# EAGLE design Backplane 2013 (EAGLE 5.06)
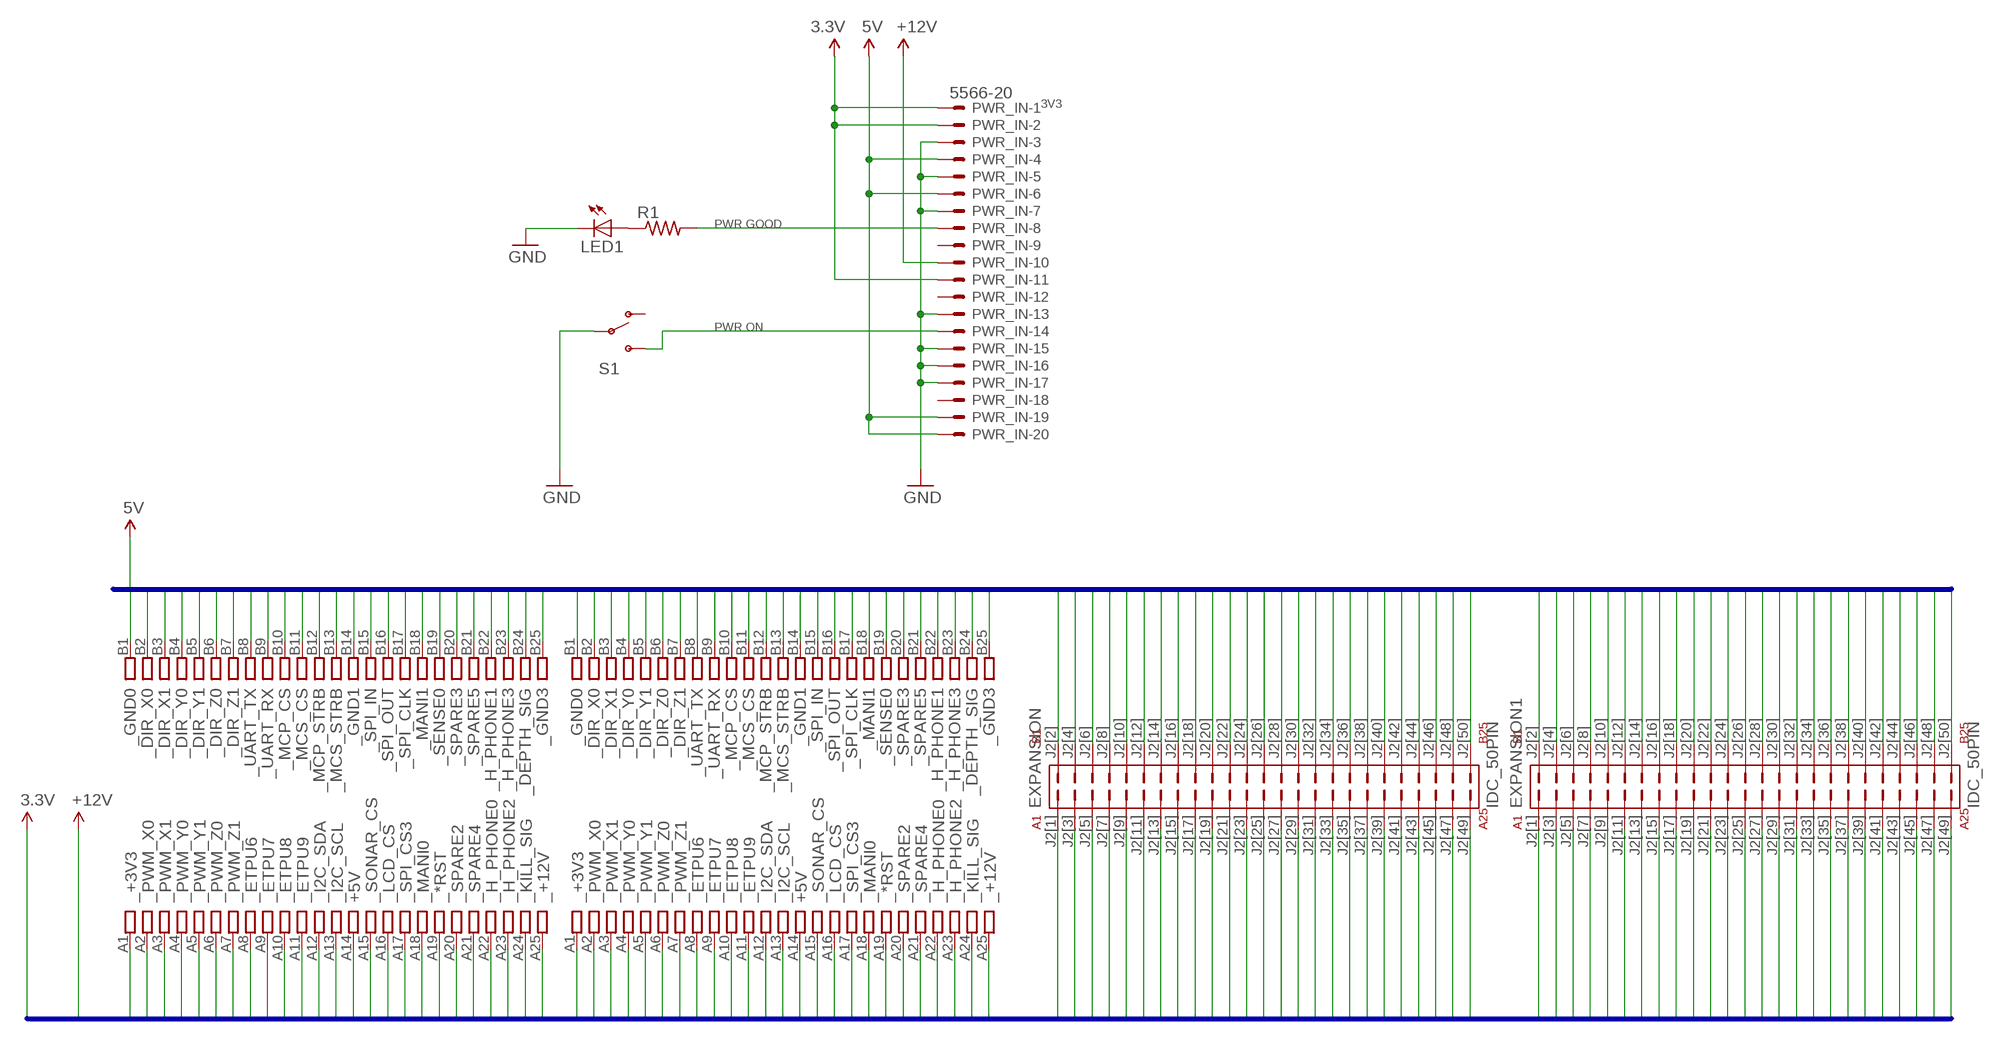
[diagram p0: schematic, sheet 1]

## Parts
EXPANSION  IDC_50PIN  [50PIN_BREAKOUT]
EXPANSION1  IDC_50PIN  [50PIN_BREAKOUT]
LED1  LED5MM  [LED5MM]
PWR_IN  5566-20  [5566-20]
R1  R-US_0204/7  [0204/7]
S1  SWITCH-SPST  [SWITCH-3PIN-5.47]
U$1  CONN_50PIN  [CONN_50PIN]
U$2  CONN_50PIN  [CONN_50PIN]

## Nets
3.3V: PWR_IN.1 PWR_IN.2 PWR_IN.11
3V3: EXPANSION1.J2[1](A1) EXPANSION.J2[1](A1) U$1.A1 U$2.A1 ; supply symbol labelled 3.3V
5V: EXPANSION1.J2[2](B1) EXPANSION.J2[2](B1) PWR_IN.4 PWR_IN.6 PWR_IN.19 PWR_IN.20 U$1.B1 U$2.B1
12V: EXPANSION1.J2[49](A25) EXPANSION.J2[49](A25) PWR_IN.10 U$1.A25 U$2.A25 ; supply symbol labelled +12V
DEPTH_SIG: EXPANSION1.J2[47](A24) EXPANSION.J2[47](A24) U$1.A24 U$2.A24
DIR_X0: EXPANSION1.J2[4](B2) EXPANSION.J2[4](B2) U$1.B2 U$2.B2
DIR_X1: EXPANSION1.J2[6](B3) EXPANSION.J2[6](B3) U$1.B3 U$2.B3
DIR_Y0: EXPANSION1.J2[8](B4) EXPANSION.J2[8](B4) U$1.B4 U$2.B4
DIR_Y1: EXPANSION1.J2[10](B5) EXPANSION.J2[10](B5) U$1.B5 U$2.B5
DIR_Z0: EXPANSION1.J2[12](B6) EXPANSION.J2[12](B6) U$1.B6 U$2.B6
DIR_Z1: EXPANSION1.J2[14](B7) EXPANSION.J2[14](B7) U$1.B7 U$2.B7
ETPU6: EXPANSION1.J2[15](A8) EXPANSION.J2[15](A8) U$1.A8 U$2.A8
ETPU7: EXPANSION1.J2[17](A9) EXPANSION.J2[17](A9) U$1.A9 U$2.A9
ETPU8: EXPANSION1.J2[19](A10) EXPANSION.J2[19](A10) U$1.A10 U$2.A10
ETPU9: EXPANSION1.J2[21](A11) EXPANSION.J2[21](A11) U$1.A11 U$2.A11
GND: EXPANSION1.J2[27](A14) EXPANSION1.J2[28](B14) EXPANSION1.J2[50](B25) EXPANSION.J2[27](A14) EXPANSION.J2[28](B14) EXPANSION.J2[50](B25) LED1.K(C) PWR_IN.3 PWR_IN.5 PWR_IN.7 PWR_IN.13 PWR_IN.15 PWR_IN.16 PWR_IN.17 S1.P$2(P) U$1.A14 U$1.B14 U$1.B25 U$2.A14 U$2.B14 U$2.B25
H_PHONE0: EXPANSION1.J2[43](A22) EXPANSION.J2[43](A22) U$1.A22 U$2.A22
H_PHONE1: EXPANSION1.J2[44](B22) EXPANSION.J2[44](B22) U$1.B22 U$2.B22
H_PHONE2: EXPANSION1.J2[45](A23) EXPANSION.J2[45](A23) U$1.A23 U$2.A23
H_PHONE3: EXPANSION1.J2[46](B23) EXPANSION.J2[46](B23) U$1.B23 U$2.B23
I2C_SCL: EXPANSION1.J2[25](A13) EXPANSION.J2[25](A13) U$1.A13 U$2.A13
I2C_SDA: EXPANSION1.J2[23](A12) EXPANSION.J2[23](A12) U$1.A12 U$2.A12
KILL_SIG: EXPANSION1.J2[48](B24) EXPANSION.J2[48](B24) U$1.B24 U$2.B24
MANI0: EXPANSION1.J2[35](A18) EXPANSION.J2[35](A18) U$1.A18 U$2.A18
MANI1: EXPANSION1.J2[36](B18) EXPANSION.J2[36](B18) U$1.B18 U$2.B18
MANI2: EXPANSION1.J2[37](A19) EXPANSION.J2[37](A19) U$1.A19 U$2.A19
MCP_CS: EXPANSION1.J2[20](B10) EXPANSION.J2[20](B10) U$1.B10 U$2.B10
MCP_STRB: EXPANSION1.J2[22](B11) EXPANSION.J2[22](B11) U$1.B11 U$2.B11
MCS_CS: EXPANSION1.J2[24](B12) EXPANSION.J2[24](B12) U$1.B12 U$2.B12
MCS_STRB: EXPANSION1.J2[26](B13) EXPANSION.J2[26](B13) U$1.B13 U$2.B13
N$1: LED1.A R1.1
N$10: PWR_IN.14 S1.P$3(S)
N$11: PWR_IN.8 R1.2
PWM_X0: EXPANSION1.J2[3](A2) EXPANSION.J2[3](A2) U$1.A2 U$2.A2
PWM_X1: EXPANSION1.J2[5](A3) EXPANSION.J2[5](A3) U$1.A3 U$2.A3
PWM_Y0: EXPANSION1.J2[7](A4) EXPANSION.J2[7](A4) U$1.A4 U$2.A4
PWM_Y1: EXPANSION1.J2[9](A5) EXPANSION.J2[9](A5) U$1.A5 U$2.A5
PWM_Z0: EXPANSION1.J2[11](A6) EXPANSION.J2[11](A6) U$1.A6 U$2.A6
PWM_Z1: EXPANSION1.J2[13](A7) EXPANSION.J2[13](A7) U$1.A7 U$2.A7
SENSE0: EXPANSION1.J2[38](B19) EXPANSION.J2[38](B19) U$1.B19 U$2.B19
SPARE0: EXPANSION1.J2[16](B8) EXPANSION.J2[16](B8) U$1.B8 U$2.B8
SPARE1: EXPANSION1.J2[18](B9) EXPANSION.J2[18](B9) U$1.B9 U$2.B9
SPARE2: EXPANSION1.J2[39](A20) EXPANSION.J2[39](A20) U$1.A20 U$2.A20
SPARE3: EXPANSION1.J2[40](B20) EXPANSION.J2[40](B20) U$1.B20 U$2.B20
SPARE4: EXPANSION1.J2[41](A21) EXPANSION.J2[41](A21) U$1.A21 U$2.A21
SPARE5: EXPANSION1.J2[42](B21) EXPANSION.J2[42](B21) U$1.B21 U$2.B21
SPI_CLK: EXPANSION1.J2[33](A17) EXPANSION.J2[33](A17) U$1.A17 U$2.A17
SPI_CS1: EXPANSION1.J2[30](B15) EXPANSION.J2[30](B15) U$1.B15 U$2.B15
SPI_CS2: EXPANSION1.J2[32](B16) EXPANSION.J2[32](B16) U$1.B16 U$2.B16
SPI_CS3: EXPANSION1.J2[34](B17) EXPANSION.J2[34](B17) U$1.B17 U$2.B17
SPI_IN: EXPANSION1.J2[29](A15) EXPANSION.J2[29](A15) U$1.A15 U$2.A15
SPI_OUT: EXPANSION1.J2[31](A16) EXPANSION.J2[31](A16) U$1.A16 U$2.A16
Unconnected: PWR_IN.9 PWR_IN.12 PWR_IN.18 S1.P$1(O)

## Buses
5V,DIR_X0,DIR_X1,DIR_Y0,DIR_Y1,DIR_Z0,DIR_Z1,MCP_CS,MCP_STRB,MCS_CS,MCS_STRB,GND,SPI_CS1,SPI_CS2,SPI_CS3,MANI1,SENSE0,H_PHONE1,H_PHONE3,KILL_SIG,SPARE0,SPARE1,SPARE3,SPARE5
3V3,PWM_X0,PWM_X1,PWM_Y0,PWM_Y1,PWM_Z0,PWM_Z1,ETPU6,ETPU7,ETPU8,ETPU9,I2C_SDA,I2C_SCL,GND,SPI_IN,SPI_OUT,SPI_CLK,MANI0,MANI2,SPARE2,SPARE4,H_PHONE0,H_PHONE2,DEPTH_SIG,12V

## Notes on the sheet
- 3V3
- PWR GOOD
- PWR ON

## Library data of the parts
EXPANSION EXPANSION1 = ARVP:IDC_50PIN
LED1 = led:LED: LED OSRAM: - CHIPLED LG R971, LG N971, LY N971, LG Q971, LY Q971, LO R971, LY R971 LH N974, LH R974 LS Q976, LO Q976, LY Q976 LO Q996 - Hyper CHIPLED LW Q18S LB Q993, LB Q99A, LB R99A - SideLED LS A670, LO A670, LY A670, LG A670, LP A670 LB A673, LV A673, LT A673, LW A673 LH A674 LY A675 LS A676, LA A676, LO A676, LY A676, LW A676 LS A679, LY A679, LG A679 - Hyper Micro SIDELED® LS Y876, LA Y876, LO Y876, LY Y876 LT Y87S - SmartLED LW L88C, LW L88S LB L89C, LB L89S, LG L890 LS L89K, LO L89K, LY L89K LS L896, LA L896, LO L896, LY L896 - TOPLED LS T670, LO T670, LY T670, LG T670, LP T670 LSG T670, LSP T670, LSY T670, LOP T670, LYG T670 LG T671, LOG T671, LSG T671 LB T673, LV T673, LT T673, LW T673 LH T674 LS T676, LA T676, LO T676, LY T676, LB T676, LH T676, LSB T676, LW T676 LB T67C, LV T67C, LT T67C, LS T67K, LO T67K, LY T67K, LW E67C LS E67B, LA E67B, LO E67B, LY E67B, LB E67C, LV E67C, LT E67C LW T67C LS T679, LY T679, LG T679 LS T770, LO T770, LY T770, LG T770, LP T770 LB T773, LV T773, LT T773, LW T773 LH T774 LS E675, LA E675, LY E675, LS T675 LS T776, LA T776, LO T776, LY T776, LB T776 LHGB T686 LT T68C, LB T68C - Hyper Mini TOPLED® LB M676 - Mini TOPLED Santana® LG M470 LS M47K, LO M47K, LY M47K Source: http://www.osram.convergy.de LUXEON: - LUMILED® LXK2-PW12-R00, LXK2-PW12-S00, LXK2-PW14-U00, LXK2-PW14-V00 LXK2-PM12-R00, LXK2-PM12-S00, LXK2-PM14-U00 LXK2-PE12-Q00, LXK2-PE12-R00, LXK2-PE12-S00, LXK2-PE14-T00, LXK2-PE14-U00 LXK2-PB12-K00, LXK2-PB12-L00, LXK2-PB12-M00, LXK2-PB14-N00, LXK2-PB14-P00, LXK2-PB14-Q00 LXK2-PR12-L00, LXK2-PR12-M00, LXK2-PR14-Q00, LXK2-PR14-R00 LXK2-PD12-Q00, LXK2-PD12-R00, LXK2-PD12-S00 LXK2-PH12-R00, LXK2-PH12-S00 LXK2-PL12-P00, LXK2-PL12-Q00, LXK2-PL12-R00 Source: www.luxeon.com KINGBRIGHT: KA-3528ASYC Source: www.kingbright.com
PWR_IN = con-molex:5566-20: Mini FIT connector 20 pol ATX PC-Motherboard Power connector Source: http://www.molex.com; OC_FARNELL: unknown; OC_NEWARK: unknown
R1 = resistor:R-US_: RESISTOR, American symbol
S1 = ARVP:SWITCH-SPST: SPST Switch Simple slide switch. Spark Fun Electronics SKU : COM-00102
U$1 U$2 = ARVP:CONN_50PIN

## Board
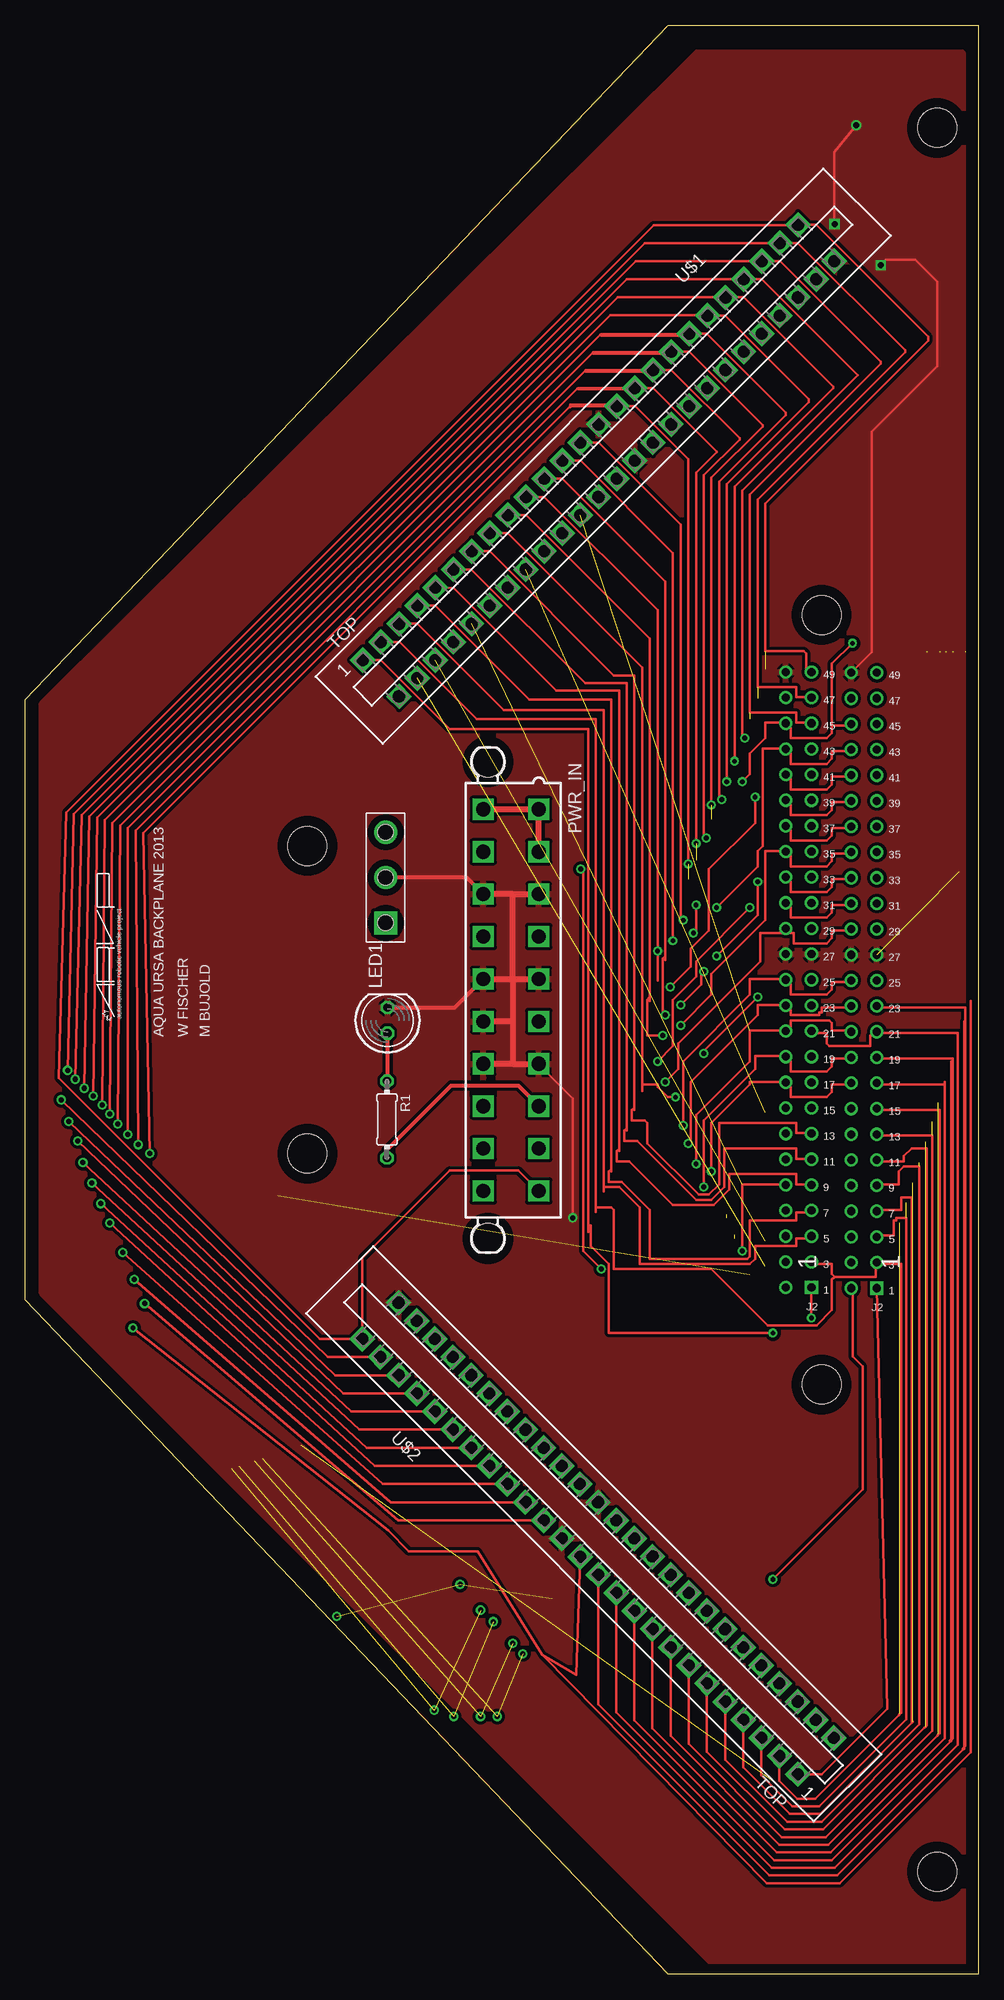
[diagram p1: board, top side]
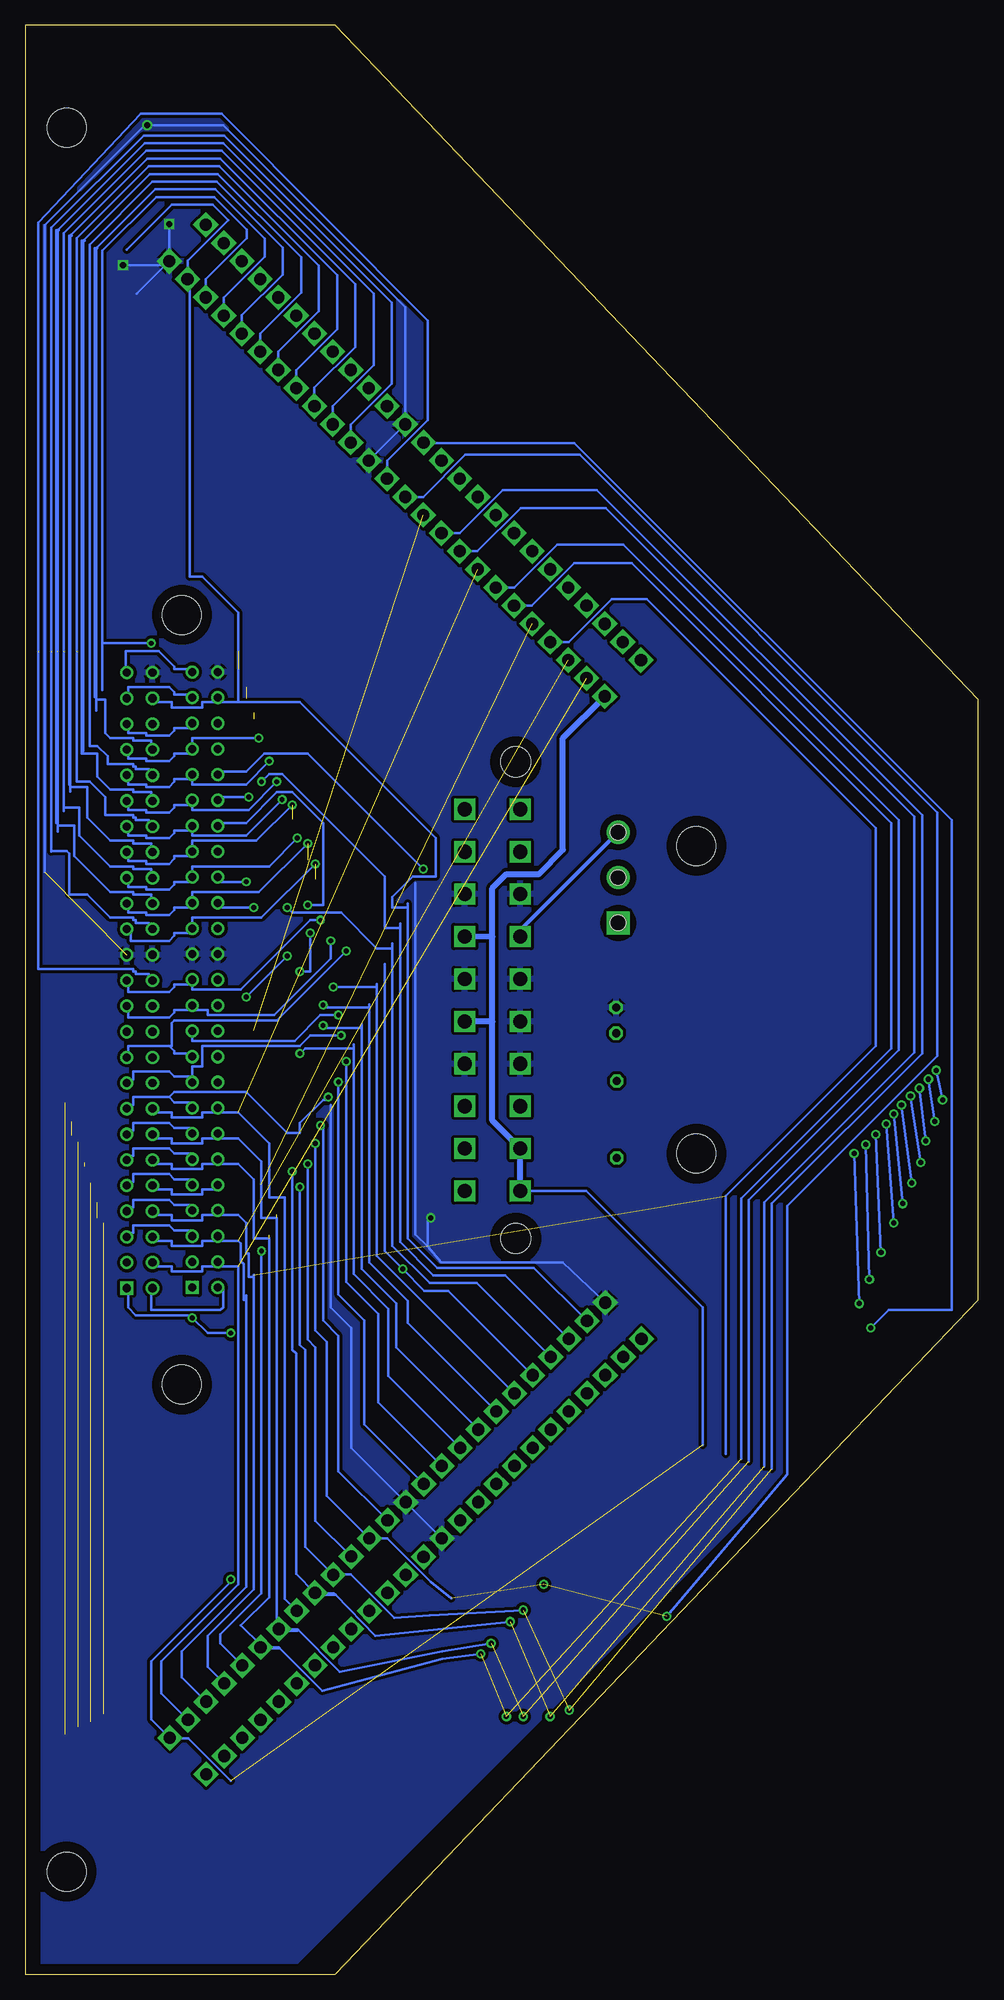
[diagram p2: board, bottom side, seen from below]

Size 94.39 x 193.04 mm. Coordinates in mm from the lower left corner, seen from the top.
Outline: 0,126.24 63.68,193.04 94.39,193.04 94.39,0 63.68,0 0,66.8 0,126.24
Copper layers (1*16): Top 0.035mm / dielectric 1.5mm / Bottom 0.035mm
Design rules "default *": minimum track width 10mil, minimum drill 19mil, track to track 7mil, track to pad 7mil, pad to pad 7mil, via to via 7mil, smd to smd 7mil, copper to edge 40mil, drill to drill 8mil, minimum pad ring 10mil, minimum via ring 8mil, stop-mask expansion 4mil, vias tented up to drill 0mil, thermal gap 10mil
Holes 3.86 mm at 27.94,111.76 90.3,182.88 90.3,10.16 27.94,81.28 78.87,134.62 78.87,58.42

### Footprints (pad centres in the part's own frame; a part is rotated, then mirrored left to right if it is on the bottom)
50PIN_BREAKOUT = drill 0.8 square: J2[1] -0.508,24.892 | drill 0.8 round: J2[2] 2.032,24.892; J2[3] -0.508,22.352; J2[4] 2.032,22.352; J2[5] -0.508,19.812; J2[6] 2.032,19.812; J2[7] -0.508,17.272; J2[8] 2.032,17.272; J2[9] -0.508,14.732; J2[10] 2.032,14.732; J2[11] -0.508,12.192; J2[12] 2.032,12.192; J2[13] -0.508,9.652; J2[14] 2.032,9.652; J2[15] -0.508,7.112; J2[16] 2.032,7.112; J2[17] -0.508,4.572; J2[18] 2.032,4.572; J2[19] -0.508,2.032; J2[20] 2.032,2.032; J2[21] -0.508,-0.508; J2[22] 2.032,-0.508; J2[23] -0.508,-3.048; J2[24] 2.032,-3.048; J2[25] -0.508,-5.588; J2[26] 2.032,-5.588; J2[27] -0.508,-8.128; J2[28] 2.032,-8.128; J2[29] -0.508,-10.668; J2[30] 2.032,-10.668; J2[31] -0.508,-13.208; J2[32] 2.032,-13.208; J2[33] -0.508,-15.748; J2[34] 2.032,-15.748; J2[35] -0.508,-18.288; J2[36] 2.032,-18.288; J2[37] -0.508,-20.828; J2[38] 2.032,-20.828; J2[39] -0.508,-23.368; J2[40] 2.032,-23.368; J2[41] -0.508,-25.908; J2[42] 2.032,-25.908; J2[43] -0.508,-28.448; J2[44] 2.032,-28.448; J2[45] -0.508,-30.988; J2[46] 2.032,-30.988; J2[47] -0.508,-33.528; J2[48] 2.032,-33.528; J2[49] -0.508,-36.068; J2[50] 2.032,-36.068
LED5MM = drill 0.813 octagon: A -1.27,0; K 1.27,0
5566-20 = drill 1.4 square: 1 18.9,-2.75; 2 14.7,-2.75; 3 10.5,-2.75; 4 6.3,-2.75; 5 2.1,-2.75; 6 -2.1,-2.75; 7 -6.3,-2.75; 8 -10.5,-2.75; 9 -14.7,-2.75; 10 -18.9,-2.75; 11 18.9,2.75; 12 14.7,2.75; 13 10.5,2.75; 14 6.3,2.75; 15 2.1,2.75; 16 -2.1,2.75; 17 -6.3,2.75; 18 -10.5,2.75; 19 -14.7,2.75; 20 -18.9,2.75 | hole 3: 23.6,2.29; -23.6,2.29
0204/7 = drill 0.813 octagon: 1 -3.81,0; 2 3.81,0
SWITCH-3PIN-5.47 = drill 1.524 square: P$1 0,0 | drill 1.524 round: P$2 0,-4.483; P$3 0,-8.966 | hole 1.524: 0,0; 0,-4.483; 0,-8.966
CONN_50PIN = drill 1.2 pad 1.778 square: A1 -30.446,-2.446; A2 -27.906,-2.446; A3 -25.366,-2.446; A4 -22.826,-2.446; A5 -20.286,-2.446; A6 -17.746,-2.446; A7 -15.206,-2.446; A8 -12.666,-2.446; A9 -10.126,-2.446; A10 -7.586,-2.446; A11 -5.046,-2.446; A12 -2.506,-2.446; A13 0,-2.446; A14 2.574,-2.446; A15 5.114,-2.446; A16 7.654,-2.446; A17 10.194,-2.446; A18 12.734,-2.446; A19 15.274,-2.446; A20 17.814,-2.446; A21 20.354,-2.446; A22 22.894,-2.446; A23 25.434,-2.446; A24 27.974,-2.446; A25 30.514,-2.446; B1 -30.446,-7.526; B2 -27.906,-7.526; B3 -25.366,-7.526; B4 -22.826,-7.526; B5 -20.286,-7.526; B6 -17.746,-7.526; B7 -15.206,-7.526; B8 -12.666,-7.526; B9 -10.126,-7.526; B10 -7.586,-7.526; B11 -5.046,-7.526; B12 -2.506,-7.526; B13 0.034,-7.526; B14 2.574,-7.526; B15 5.114,-7.526; B16 7.654,-7.526; B17 10.194,-7.526; B18 12.734,-7.526; B19 15.274,-7.526; B20 17.814,-7.526; B21 20.354,-7.526; B22 22.894,-7.526; B23 25.434,-7.526; B24 27.974,-7.526; B25 30.514,-7.526

### Placement (x,y rotation side)
EXPANSION  83.82,92.85 180 top
EXPANSION1  77.34,92.91 180 top
LED1  35.87,94.48 90 top
PWR_IN  48.11,96.48 90 top
R1  35.82,84.66 270 top
S1  35.69,104.14 180 top
U$1  53.22,153.42 45 top
U$2  53.22,39.62 135 top
U$3  [ARVP]  9.53,94.61 90 top

### Tracks (layer width: path | path; a pad name or v marks a point on that pad's centre or on a via)
3.3V
  Top 0.61: PWR_IN.11 PWR_IN.1 PWR_IN.2
3V3  (via drill 0.48)
  Top 0.254: U$1.A1 35.19,130.16 42.04,123.32 55.75,123.32 55.75,74.17 | 55.75,74.17 55.75,73.53 | U$2.A1 78.88,19.82 85.34,26.28 EXPANSION.J2[1] | v77.85,65.02 EXPANSION1.J2[1] | v74.04,63.5 57.79,63.5 57.79,70.36 56.01,72.14 56.01,74.17 55.75,74.17
  Bottom 0.254: EXPANSION.J2[1] 84.2,67.82 84.2,66.04 83.44,65.28 78.1,65.28 v77.85,65.02 76.33,63.5 v74.04,63.5
5V  (via drill 0.48)  (1 unrouted)
  Top 0.254: v74.04,39.12 82.93,48.01 82.93,60.2 81.91,61.21 81.91,67.82 EXPANSION.J2[2]
  Bottom 0.254: 79.88,23.37 78.23,23.37 74.04,19.18 | 79.88,23.37 80.01,23.37 | PWR_IN.20 38.84,77.58 27.3,66.04 27.3,52.45 | EXPANSION.J2[2] 81.91,67.82 81.91,65.79 75.06,65.79 74.8,66.04 74.8,67.82 75.31,67.82 EXPANSION1.J2[2] | v74.04,39.12 74.04,38.86 81.91,30.99 81.91,25.26 U$2.B1 79.88,23.37
  Bottom 0.61: PWR_IN.20 PWR_IN.19 48.13,84.56 48.13,94.36 | U$1.B1 41.15,122.43 41.15,111.38 43.56,108.97 46.74,108.97 48.13,107.57 48.13,102.74 | 48.13,94.36 48.13,102.74 | 48.13,94.36 PWR_IN.6 | 48.13,102.74 PWR_IN.4
12V  (1 unrouted)
  Top 0.254: 76.33,173.23 62.23,173.23 4.06,115.06 3.3,88.77 29.15,62.93 U$2.A25 33.37,70.96 42.04,79.63 48.81,79.63 PWR_IN.10 | 76.33,173.23 76.45,173.23 | EXPANSION1.J2[49] 77.85,129.03 77.34,129.03 77.34,130.81 77.09,131.06 73.28,131.06 73.28,145.67 89.41,161.8 89.41,162.18 78.32,173.27 U$1.A25 76.33,173.23
  Bottom 0.254: EXPANSION.J2[49] 84.46,129.03 84.46,131.06 81.15,131.06 79.63,129.54 79.63,129.29 78.1,129.29 77.85,129.03 EXPANSION1.J2[49]
DEPTH_SIG  (via drill 0.5)  (1 unrouted)
  Top 0.254: 74.55,171.45 61.34,171.45 4.83,114.94 v4.19,89.53 | 74.55,171.45 74.68,171.45 | v3.56,86.61 29.93,61.13 U$2.A24 | EXPANSION1.J2[47] 77.85,126.49 76.33,126.49 76.33,127.51 72.52,127.51 72.52,146.05 87.12,160.66 87.12,160.85 76.5,171.47 U$1.A24 74.55,171.45
  Bottom 0.254: v3.56,86.61 v4.19,89.53 | EXPANSION.J2[47] 84.2,126.49 84.2,127.51 80.14,127.51 79.63,127 79.63,126.75 78.1,126.75 77.85,126.49 EXPANSION1.J2[47]
DIR_X0  (1 unrouted)
  Bottom 0.254: U$2.B2 80.9,27.84 80.9,30.99 73.28,38.61 73.28,70.1 75.06,70.1 75.31,70.36 | 75.31,70.36 75.56,70.1 76.84,70.1 76.84,69.6 79.88,69.6 79.88,70.1 81.41,70.1 81.66,70.36 EXPANSION.J2[4] | 75.31,70.36 EXPANSION1.J2[4]
DIR_X1  (1 unrouted)
  Bottom 0.254: 72.52,66.8 72.52,38.35 78.87,32 78.87,29.4 U$2.B3 | 72.52,66.8 72.52,67.25 | 75.31,72.9 75.56,72.64 76.84,72.64 76.84,72.14 79.88,72.14 79.88,72.64 81.41,72.64 81.66,72.9 EXPANSION.J2[6] | 75.31,72.9 75.06,72.64 73.28,72.64 73.03,72.39 73.03,70.61 72.77,70.36 72.77,66.8 72.52,66.8 | 75.31,72.9 EXPANSION1.J2[6]
DIR_Y0  (1 unrouted)
  Bottom 0.254: 71.75,69.09 71.75,38.1 76.33,33.53 76.33,30.45 U$2.B4 | 71.75,69.09 71.75,69.25 | U$1.B4 40.57,131.96 36.32,136.21 32.83,136.21 10.16,113.54 10.16,91.95 25.02,77.09 25.02,51.56 | 75.31,75.44 75.56,75.18 76.84,75.18 76.84,74.68 79.88,74.68 79.88,75.18 81.41,75.18 81.66,75.44 EXPANSION.J2[8] | 75.31,75.44 75.06,75.18 73.28,75.18 72.52,74.42 72.52,71.37 72.26,71.37 72.26,69.09 71.75,69.09 | 75.31,75.44 EXPANSION1.J2[8]
DIR_Y1  (via drill 0.48)  (1 unrouted)
  Top 0.254: v70.99,71.63 70.99,78.23 75.31,78.23 EXPANSION1.J2[10]
  Bottom 0.254: U$2.B5 75.06,32.77 75.06,33.65 70.99,37.72 v70.99,71.63 | EXPANSION.J2[10] 81.66,77.98 81.41,77.72 79.88,77.72 79.88,77.22 76.84,77.22 76.84,77.72 75.56,77.72 75.31,77.98 EXPANSION1.J2[10]
DIR_Z0  (via drill 0.5)  (3 unrouted)
  Bottom 0.254: 71.12,32.38 69.28,32.38 69.18,32.29 | 69.18,32.29 64.96,28.07 53.09,31.24 v49.28,31.75 | U$1.B6 44.22,135.55 40.01,139.76 34.35,139.76 8.64,114.05 8.64,91.69 23.5,76.83 23.5,51.05 | 75.31,80.52 75.56,80.26 76.84,80.26 76.84,79.76 79.88,79.76 79.88,80.26 81.41,80.26 81.66,80.52 EXPANSION.J2[12] | 75.31,80.52 75.06,80.26 73.28,80.26 71.75,78.74 71.75,72.9 70.23,72.9 70.23,37.34 73.03,34.54 71.09,32.61 U$2.B6 70.99,32.26 69.22,32.26 69.18,32.29 | 75.31,80.52 EXPANSION1.J2[12]
  other vias: 46.74,25.53
DIR_Z1  (via drill 0.5)  (3 unrouted)
  Bottom 0.254: 69.22,34.16 67.44,34.16 67.37,34.1 | 67.37,34.1 63.25,29.97 53.09,32 v48.26,32.77 | U$1.B7 45.98,137.35 41.72,141.6 35.18,141.6 7.87,114.3 7.87,91.57 22.73,76.71 22.73,50.8 | 75.31,83.06 75.56,82.8 76.84,82.8 76.84,82.3 79.88,82.3 79.88,82.8 81.41,82.8 81.66,83.06 EXPANSION.J2[14] | 75.31,83.06 75.06,82.8 73.28,82.8 70.99,80.52 70.99,74.93 69.47,74.93 69.47,34.37 U$2.B7 69.22,34.04 67.44,34.04 67.37,34.1 | 75.31,83.06 EXPANSION1.J2[14]
  other vias: 45.09,25.53
ETPU6  (via drill 0.48)  (1 unrouted)
  Top 0.254: U$1.A8 47.77,142.73 61.09,129.41 61.09,88.14 | 61.09,88.14 61.09,87.5 | U$2.A8 63.9,23.6 74.68,12.83 79.5,12.83 90.3,23.62 | 90.3,23.62 90.42,23.75 | 90.3,23.62 90.55,23.88 90.55,85.6 84.46,85.6 EXPANSION.J2[15] | 61.09,88.14 62.61,88.14 62.61,87.88 63.63,86.87 v64.39,86.87
  Bottom 0.254: 80.14,86.87 79.63,86.36 77.85,86.36 EXPANSION1.J2[15] | 80.14,86.87 83.69,86.87 83.69,86.11 84.2,86.11 84.46,85.85 EXPANSION.J2[15] | v64.39,86.87 64.39,86.61 64.9,86.61 67.18,84.33 67.18,83.31 68.45,83.31 72.52,87.38 79.63,87.38 80.14,86.87
ETPU7  (via drill 0.48)
  Top 0.254: U$1.A9 49.59,144.53 61.85,132.27 61.85,96.77 | 61.85,96.77 61.85,96.39 | U$2.A9 62.11,24.38 74.42,12.06 79.76,12.06 91.06,23.37 91.06,88.14 | 91.06,88.14 91.06,88.39 | 91.06,88.14 84.46,88.14 EXPANSION.J2[17] | v63.12,92.96 61.6,92.96 61.6,96.52 61.85,96.77
  Bottom 0.254: 77.85,88.9 79.63,88.9 80.14,89.41 83.69,89.41 83.69,88.65 84.2,88.65 84.46,88.39 EXPANSION.J2[17] | 77.85,88.9 EXPANSION1.J2[17] 77.85,88.9 | 77.85,88.9 77.85,89.92 76.84,89.92 76.84,91.95 67.18,91.95 66.17,92.96 v63.12,92.96
ETPU8  (via drill 0.48)
  Top 0.254: U$1.A10 51.41,146.33 62.61,135.13 v62.61,101.35 62.61,98.42 | U$2.A10 60.31,25.16 74.17,11.3 79.88,11.3 91.63,23.05 | 91.63,23.05 91.69,23.11 91.69,90.42 | EXPANSION.J2[19] 84.46,90.68 91.82,90.68 91.82,23.37 91.57,23.11 91.63,23.05
  Bottom 0.254: 80.14,91.95 84.2,91.95 84.2,90.93 EXPANSION.J2[19] | 80.14,91.95 79.63,91.44 79.63,91.19 78.1,91.19 77.85,90.93 EXPANSION1.J2[19] | v62.61,101.35 69.47,94.49 79.63,94.49 79.88,94.23 79.88,91.95 80.14,91.95
ETPU9  (via drill 0.48)
  Top 0.254: U$1.A11 53.17,148.12 63.37,137.92 63.37,100.84 | 63.37,100.84 63.37,100.46 | U$2.A11 58.51,25.94 73.91,10.54 80.14,10.54 92.33,22.73 92.33,93.22 84.46,93.22 EXPANSION.J2[21] 84.2,93.22 84.2,92.96 83.69,92.96 83.69,91.95 79.63,91.95 79.38,92.2 79.38,93.22 77.85,93.22 EXPANSION1.J2[21] | v63.37,95 63.12,95.25 63.12,100.58 63.37,100.84
  Bottom 0.254: v63.37,95 65.15,95 67.69,92.46 77.85,92.46 EXPANSION1.J2[21]
GND  (via drill 0.5, 0.6)  (1 unrouted)
  Top 0.254: 50.8,90.17 54.23,86.74 v54.23,74.93 | v82.3,183.13 80.12,180.44 80.12,172.87 v80.14,173.35 | EXPANSION.J2[50] 83.81,130.94 83.81,152.77 90.3,159.26 90.3,167.64 88.14,169.8 85.22,169.8 v84.71,169.29
  Top 0.406: LED1.K 42.53,95.75 PWR_IN.15 | S1.P$2 43.71,108.62 PWR_IN.13
  Top 0.61: 48.26,106.98 PWR_IN.13 | 48.26,106.98 PWR_IN.3 | 48.26,98.58 PWR_IN.5 | 48.26,98.58 48.26,106.98 | 48.26,94.38 PWR_IN.16 | 48.26,98.58 48.26,94.38 | PWR_IN.15 48.26,98.58 | 48.26,94.38 48.26,90.18 | 48.26,90.18 PWR_IN.7 | 48.26,90.18 PWR_IN.17
  Bottom 0.254: U$2.B25 41.18,70.48 53.21,70.48 54.55,72.07 | 54.55,72.07 55.75,73.28 55.75,108.07 | U$2.A14 U$2.B14 62.1,52.15 62.1,64.01 64.13,66.04 64.13,86.07 | U$1.B25 83.34,166.45 | U$1.B14 U$1.A14 56.77,165.1 74.8,183.13 v82.3,183.13 82.55,183.13 92.46,173.23 92.46,130.94 | 92.46,109.16 92.46,130.94 | 92.46,130.94 92.46,131.06 | v54.23,74.93 54.55,74.61 54.55,72.07 | v80.14,173.35 80.14,169.7 U$1.B25 | v84.71,169.29 80.5,169.29 U$1.B25
  pour Top (isolate 0.305): 66.55,190.37 92.71,190.37 92.84,190.25 92.84,0.76 68.33,0.76 1.65,67.44 1.65,125.6 1.65,125.86
  pour Bottom (isolate 0.305): 66.29,190.37 92.46,190.37 92.58,190.25 92.58,0.76 68.07,0.76 1.4,67.44 1.4,125.86
H_PHONE0  (via drill 0.48, 0.5)
  Top 0.254: 70.99,122.43 70.99,122.3 | 70.99,122.43 70.99,146.94 82.42,158.37 72.91,167.88 U$1.A22 70.99,167.89 | 70.99,167.89 59.56,167.89 6.35,114.68 v5.84,87.76 | 70.99,167.89 71.12,167.89 | v5.21,82.55 31.49,57.54 U$2.A22 | 70.99,122.43 v71.25,122.43
  Bottom 0.254: v5.84,87.76 v5.21,82.55 | EXPANSION.J2[43] 84.2,121.16 84.2,120.4 82.42,120.4 82.42,120.14 80.14,120.14 79.63,120.65 79.63,120.9 78.1,120.9 77.85,121.16 EXPANSION1.J2[43] 77.85,122.43 v71.25,122.43
H_PHONE1  (via drill 0.48)
  Top 0.254: 75.31,121.41 75.82,120.9 75.82,119.89 79.38,119.89 79.88,120.4 79.88,121.16 81.66,121.16 EXPANSION.J2[44] | 75.31,121.41 73.03,121.41 73.03,111.76 72.52,111.25 72.52,109.73 v68.45,105.66 | 75.31,121.41 EXPANSION1.J2[44]
  Bottom 0.254: U$2.B22 49.67,68.45 54.36,68.45 58.04,72.14 58.04,101.6 | 58.04,101.6 58.04,102.07 | U$1.B22 74.73,166.06 70.68,170.12 70.68,171.89 75.56,176.78 81.53,176.78 87.31,171.01 | 87.31,171.01 87.38,170.94 87.38,125.16 | v68.45,105.66 67.94,105.16 63.12,105.16 59.56,101.6 58.04,101.6 | EXPANSION.J2[44] 81.91,121.41 81.91,122.17 83.69,122.17 83.69,122.43 85.98,122.43 86.49,122.94 86.49,126.24 87.25,126.24 87.5,126.49 87.5,170.94 87.25,170.94 87.31,171.01
H_PHONE2  (via drill 0.5)  (1 unrouted)
  Top 0.254: 72.77,169.67 60.45,169.67 5.59,114.81 v4.95,88.65 | 72.77,169.67 72.9,169.67 | v4.32,84.45 30.71,59.33 U$2.A23 | EXPANSION1.J2[45] 77.85,123.95 76.33,123.95 76.33,124.97 71.75,124.97 71.75,146.56 84.71,159.51 84.71,159.7 74.74,169.68 U$1.A23 72.77,169.67
  Bottom 0.254: v4.95,88.65 v4.32,84.45 | EXPANSION.J2[45] 84.2,123.7 84.2,122.94 82.42,122.94 82.42,122.68 80.14,122.68 79.63,123.19 79.63,123.44 78.1,123.44 77.85,123.7 EXPANSION1.J2[45]
H_PHONE3  (via drill 0.48)
  Top 0.254: 79.88,123.7 81.66,123.7 EXPANSION.J2[46] | 79.88,123.7 79.88,122.94 79.38,122.43 75.82,122.43 75.82,123.44 75.31,123.95 | 79.88,123.7 79.88,129.79 v81.91,131.83 | 75.31,123.95 73.28,123.95 73.28,122.43 71.75,120.9 71.75,118.87 v70.99,118.11 | 75.31,123.95 EXPANSION1.J2[46]
  Bottom 0.254: U$2.B23 46.84,69.22 53.98,69.22 57.28,72.52 57.28,103.63 | 57.28,103.63 57.28,104.07 | U$1.B23 76.52,167.89 72.45,171.96 72.45,172.78 75.69,176.02 81.41,176.02 86.74,170.69 86.74,131.83 | 86.74,131.83 86.74,127.19 | v81.91,131.83 86.74,131.83 | v70.99,118.11 70.23,118.87 68.96,118.87 58.8,108.71 58.8,103.63 57.28,103.63
I2C_SCL  (via drill 0.48)
  Top 0.254: U$1.A13 56.78,151.69 64.9,143.57 64.9,104.39 v65.15,104.39 | U$2.A13 54.56,29.64 51.18,31.62 | 51.18,31.62 73.41,9.02 80.65,9.02 93.6,21.97 93.6,96.39 | v10.67,64.01 35.94,43.94 37.97,41.91 44.83,41.91 51.18,31.62
  Bottom 0.254: 77.85,98.3 78.1,98.04 79.63,98.04 79.63,97.79 80.14,97.28 84.2,97.28 84.2,98.3 EXPANSION.J2[25] | 77.85,98.3 77.85,97.54 73.03,97.54 66.17,104.39 v65.15,104.39 | 77.85,98.3 EXPANSION1.J2[25] | U$1.A13 54.74,151.64 40.01,151.64 2.67,114.3 2.67,65.79 8.89,65.79 v10.67,64.01
I2C_SDA  (via drill 0.48)
  Top 0.254: U$1.A12 55,149.92 64.13,140.78 v64.13,102.36 64.13,102.23 | U$2.A12 56.72,26.72 73.66,9.78 80.39,9.78 92.9,22.29 | 92.9,22.29 92.96,22.35 92.96,94.36 | EXPANSION.J2[23] 84.46,95.76 93.09,95.76 93.09,22.61 92.84,22.35 92.9,22.29
  Bottom 0.254: 78.1,95.5 79.63,95.5 79.63,95.25 80.14,94.74 84.2,94.74 84.2,95.76 EXPANSION.J2[23] | 78.1,95.5 77.85,95.76 EXPANSION1.J2[23] 78.1,95.5 | v64.13,102.36 64.13,100.58 69.72,95 76.33,95 76.33,95.5 78.1,95.5
KILL_SIG
  Bottom 0.254: U$2.B24 44.01,69.98 53.59,69.98 56.52,72.9 56.52,105.66 | 56.52,105.66 56.52,106.07 | 84.33,170.81 79.88,175.26 75.82,175.26 74.29,173.74 78.32,169.71 U$1.B24 78.1,167.64 78.1,138.43 76.84,138.43 73.28,134.87 73.28,125.98 | 75.31,126.24 75.56,125.98 76.84,125.98 76.84,125.48 79.88,125.48 79.88,125.98 81.41,125.98 81.66,126.24 EXPANSION.J2[48] | 75.31,126.24 75.06,125.98 73.28,125.98 | 73.28,125.98 67.18,125.98 53.72,112.52 53.72,108.71 56.01,108.71 58.04,106.68 58.04,105.66 56.52,105.66 | 75.31,126.24 EXPANSION1.J2[48]
MANI0  (via drill 0.48, 0.5)  (1 unrouted)
  Top 0.254: v67.94,115.82 67.94,148.21 73.03,153.29 73.03,153.42 65.75,160.69 U$1.A18 63.88,160.53 56.26,160.53 56.2,160.59 | 63.88,160.66 56.26,160.66 56.2,160.59 | 56.2,160.59 9.4,113.79 v9.14,84.2 | v8.38,74.42 34.61,50.35 U$2.A18
  Bottom 0.254: v8.38,74.42 v9.14,84.2 | EXPANSION.J2[35] 84.2,111 84.2,110.24 82.42,110.24 82.42,109.98 80.14,109.98 79.63,110.49 79.63,110.74 78.1,110.74 77.85,111 EXPANSION1.J2[35] 77.85,112.27 71.5,112.27 v67.94,115.82
MANI1  (via drill 0.48)
  Top 0.254: 75.31,111.25 75.82,110.74 75.82,109.73 79.38,109.73 79.88,110.24 79.88,111 81.66,111 EXPANSION.J2[36] | 75.31,111.25 73.28,111.25 73.28,104.39 67.94,99.06 67.94,97.03 v64.9,93.98 | 75.31,111.25 EXPANSION1.J2[36]
  Bottom 0.254: U$2.B18 57.66,62.07 57.66,66.42 61.09,69.85 61.09,93.73 | 61.09,93.73 61.09,94.07 | U$1.B18 67.54,158.9 63.5,162.94 63.5,168.27 75.06,179.83 82.3,179.83 89.85,172.27 | 89.85,172.27 89.92,172.21 89.92,117.16 | v64.9,93.98 64.64,93.73 61.09,93.73 | EXPANSION.J2[36] 81.91,111.25 81.91,112.01 83.69,112.01 83.69,112.27 85.98,112.27 88.26,114.55 88.26,117.6 89.79,117.6 90.04,117.86 90.04,172.21 89.79,172.21 89.85,172.27
MANI2  (via drill 0.48, 0.5)
  Top 0.254: 65.79,162.43 57.02,162.43 56.96,162.37 | 56.96,162.37 8.64,114.05 v8.38,85.22 | v7.49,76.33 33.83,52.15 U$2.A19 | v68.96,116.33 68.71,116.33 68.71,147.83 75.31,154.43 75.31,154.69 67.51,162.49 U$1.A19 65.66,162.31 57.02,162.31 56.96,162.37
  Bottom 0.254: v8.38,85.22 v7.49,76.33 | 77.85,113.54 78.1,113.28 79.63,113.28 79.63,113.03 80.14,112.52 82.42,112.52 82.42,112.78 84.2,112.78 84.2,113.54 EXPANSION.J2[37] | 77.85,113.54 77.85,112.78 72.52,112.78 v68.96,116.33 | 77.85,113.54 EXPANSION1.J2[37]
MCP_CS  (via drill 0.48, 0.5)  (2 unrouted)
  Top 0.254: 75.31,90.93 75.82,90.42 75.82,89.41 79.38,89.41 79.88,89.92 79.88,90.68 81.66,90.68 EXPANSION.J2[20] | 75.31,90.93 72.26,90.93 72.26,89.66 67.18,84.58 v67.18,77.98 | 75.31,90.93 EXPANSION1.J2[20]
  Bottom 0.254: 67.18,78.07 v67.18,77.98 67.18,62.36 66.68,61.85 66.68,42.35 U$2.B10 63.88,39.62 62.17,39.62 57.85,35.31 54.36,35.56 v45.09,36.07 | U$1.B10 51.38,142.73 47.12,147 37.78,147 5.59,114.81 5.59,91.19 20.45,76.33 20.45,50.04
  other vias: 40.51,26.16
MCP_STRB  (via drill 0.48)  (1 unrouted)
  Top 0.254: EXPANSION.J2[22] 81.66,93.47 79.88,93.47 79.88,94.23 79.63,94.49 75.82,94.49 75.82,93.73 75.31,93.22 EXPANSION1.J2[22] 75.31,93.47 71.75,93.47 71.75,90.42 66.42,85.09 v66.42,80.26
  Bottom 0.254: U$2.B11 65.66,44.93 65.66,62.1 66.42,62.86 66.42,80.01 | 66.42,80.01 66.42,80.07 | 66.42,80.01 v66.42,80.26
MCS_CS  (via drill 0.48, 0.5)  (2 unrouted)
  Top 0.254: 75.31,96.01 75.82,95.5 75.82,95 78.61,95 78.61,95.25 78.87,95.25 78.87,95.76 81.66,95.76 EXPANSION.J2[24] | 75.31,96.01 72.52,96.01 72.52,95 65.91,88.39 65.91,82.55 v65.66,82.3 | 75.31,96.01 EXPANSION1.J2[24]
  Bottom 0.254: 65.66,82.04 65.66,63.75 64.52,62.61 64.52,47.37 U$2.B12 60.32,43.18 58.55,43.18 54.23,38.86 52.2,37.21 | 65.66,82.04 65.66,82.07 | U$1.B12 54.97,146.33 50.8,150.5 39.5,150.5 4.06,115.06 4.06,90.93 18.92,76.07 18.92,49.53 v30.86,35.43 | 65.66,82.04 v65.66,82.3
  other vias: 43.05,38.61
MCS_STRB  (via drill 0.48)  (1 unrouted)
  Top 0.254: 75.31,98.55 75.82,98.04 75.82,97.03 79.38,97.03 79.88,97.54 79.88,98.3 81.66,98.3 EXPANSION.J2[26] | 75.31,98.55 71.75,98.55 71.75,97.03 65.15,90.42 v65.15,84.07 | 75.31,98.55 EXPANSION1.J2[26]
  Bottom 0.254: U$2.B13 63.37,49.82 63.37,63.25 64.9,64.77 64.9,84.07 v65.15,84.07 | U$1.B13 58.56,149.91 54.55,153.92 54.55,163.77 74.93,184.28 82.93,184.28 93.09,173.48 93.09,130.94 | 93.09,131.06 93.09,99.57 83.69,99.57 83.69,99.31 83.44,99.31 83.44,99.06 82.17,99.06 82.17,98.55 81.91,98.55 EXPANSION.J2[26]
N$1
  Top 0.406: LED1.A 35.87,88.53 R1.1
N$10
  Bottom 0.406: PWR_IN.14 45.36,103.44 S1.P$3
N$11
  Top 0.406: R1.2 35.82,81.66 42.16,88.01 48.83,88.01 PWR_IN.8
PWM_X0  (1 unrouted)
  Top 0.254: U$1.A2 37.08,131.96 44.7,124.33 56.52,124.33 56.52,75.95 | 56.52,75.95 56.52,75.5 | U$2.A2 74.68,19.17 76.45,17.4 78.23,17.4 86.49,25.65 | 86.49,25.65 86.61,25.78 | 80.14,69.09 79.88,69.34 79.88,70.36 77.85,70.36 EXPANSION1.J2[3] | 80.14,69.09 84.2,69.09 84.2,70.36 EXPANSION.J2[3] 84.46,70.36 86.74,70.36 86.74,25.91 86.49,25.65 | 80.14,69.09 79.88,68.83 79.88,65.79 78.36,64.26 73.53,64.26 67.94,69.85 58.29,69.85 58.29,75.69 58.04,75.95 56.52,75.95
PWM_X1  (1 unrouted)
  Top 0.254: U$1.A3 38.84,133.75 47.37,125.22 57.28,125.22 57.28,77.98 | 57.28,77.98 57.28,77.53 | U$2.A3 72.88,19.7 75.95,16.64 78.61,16.64 87.25,25.27 87.25,74.93 86.23,74.93 86.23,74.68 85.98,74.68 85.98,73.15 84.46,73.15 EXPANSION.J2[5] | 57.28,77.98 58.8,77.98 60.83,75.95 60.83,70.36 71.75,70.36 72.26,70.87 72.26,72.14 76.33,72.14 76.33,72.9 77.85,72.9 EXPANSION1.J2[5]
  Bottom 0.254: EXPANSION1.J2[5] 77.85,73.66 79.63,73.66 80.14,74.17 83.69,74.17 83.69,73.41 84.2,73.41 84.46,73.15 EXPANSION.J2[5]
PWM_Y0  (1 unrouted)
  Top 0.254: U$1.A4 40.6,135.55 49.91,126.24 58.04,126.24 58.04,79.76 | 58.04,79.76 58.04,79.5 | U$2.A4 71.09,20.48 75.69,15.88 78.74,15.88 87.76,24.89 | 87.76,24.89 87.88,25.02 | 87.76,24.89 87.76,76.96 86.74,76.96 86.74,75.69 84.46,75.69 EXPANSION.J2[7] | 58.04,79.76 57.79,79.5 57.79,78.49 59.05,78.49 61.85,75.69 61.85,70.87 71.5,70.87 71.75,71.12 71.75,74.68 76.33,74.68 76.33,75.44 77.85,75.44 EXPANSION1.J2[7]
  Bottom 0.254: EXPANSION1.J2[7] 77.85,76.2 79.63,76.2 80.14,76.71 83.69,76.71 83.69,75.95 84.2,75.95 84.46,75.69 EXPANSION.J2[7]
PWM_Y1  (1 unrouted)
  Top 0.254: U$1.A5 42.42,137.28 52.58,127.13 58.8,127.13 58.8,81.79 | 58.8,81.79 58.8,81.53 | U$2.A5 69.29,21.26 75.44,15.11 78.87,15.11 88.52,24.77 88.52,80.01 87,80.01 86.49,79.5 86.49,78.23 84.46,78.23 EXPANSION.J2[9] | 58.8,81.79 58.55,81.53 58.55,80.52 59.82,80.52 64.13,76.2 68.2,76.2 69.72,77.72 69.72,79.25 76.33,79.25 76.33,78.23 77.85,78.23 EXPANSION1.J2[9]
  Bottom 0.254: EXPANSION1.J2[9] 77.85,78.74 79.63,78.74 80.14,79.25 83.69,79.25 83.69,78.49 84.2,78.49 84.46,78.23 EXPANSION.J2[9]
PWM_Z0  (1 unrouted)
  Top 0.254: U$1.A6 44.18,139.14 55.44,127.89 59.56,127.89 59.56,83.82 | 59.56,83.82 59.56,83.57 | U$2.A6 67.5,22.04 75.18,14.35 78.99,14.35 89.03,24.38 | 89.03,24.38 89.15,24.51 | 89.03,24.38 89.28,24.64 89.28,81.79 87.76,81.79 87,81.03 87,80.52 84.46,80.52 EXPANSION.J2[11] | 59.56,83.82 59.31,83.57 59.31,82.55 60.58,82.55 66.42,76.71 67.94,76.71 69.22,77.98 69.22,81.79 76.33,81.79 76.33,80.77 77.85,80.77 EXPANSION1.J2[11]
  Bottom 0.254: EXPANSION1.J2[11] 77.85,81.28 79.63,81.28 80.14,81.79 83.69,81.79 83.69,81.03 84.2,81.03 84.46,80.77 EXPANSION.J2[11]
PWM_Z1  (1 unrouted)
  Top 0.254: U$1.A7 46.01,140.94 58.29,128.65 60.32,128.65 60.32,85.85 | 60.32,85.85 60.32,85.6 | U$2.A7 65.7,22.82 74.93,13.59 79.25,13.59 89.79,24.13 89.79,83.06 84.46,83.06 EXPANSION.J2[13] | 60.32,85.85 60.07,85.6 60.07,84.58 61.34,84.58 61.6,84.33 61.6,82.3 66.68,77.22 67.69,77.22 68.71,78.23 68.71,84.33 76.33,84.33 76.33,83.31 77.85,83.31 EXPANSION1.J2[13]
  Bottom 0.254: EXPANSION1.J2[13] 77.85,83.82 79.63,83.82 80.14,84.33 83.69,84.33 83.69,83.57 84.2,83.57 84.46,83.31 EXPANSION.J2[13]
SENSE0  (via drill 0.48)  (1 unrouted)
  Top 0.254: EXPANSION.J2[38] 81.66,113.54 79.88,113.54 79.88,112.78 79.38,112.27 75.82,112.27 75.82,113.28 75.31,113.79 EXPANSION1.J2[38] | v66.42,105.92 66.42,103.38 v66.17,103.12 | v67.18,99.31 66.93,99.06 66.93,98.04 v64.9,96.01
  Bottom 0.254: U$2.B19 56.52,64.52 56.52,66.67 60.32,70.48 60.32,95.76 | 60.32,95.76 60.32,96.07 | U$1.B19 69.34,160.72 65.34,164.72 65.34,169.23 75.18,179.07 82.17,179.07 89.28,171.96 89.28,130.94 | 89.28,131.06 89.28,118.11 88.01,118.11 86.49,116.59 86.49,114.81 83.69,114.81 83.69,114.55 83.44,114.55 83.44,114.3 82.17,114.3 82.17,113.79 81.91,113.79 EXPANSION.J2[38] | v66.42,105.92 64.9,105.92 64.9,114.05 67.94,117.09 69.47,117.09 72.52,114.05 75.06,114.05 75.31,113.79 EXPANSION1.J2[38] | v66.17,103.12 66.17,99.31 v67.18,99.31 | v64.9,96.01 64.64,95.76 60.32,95.76
SPARE0  (1 unrouted)
  Bottom 0.254: U$2.B8 68.71,37.2 68.71,76.96 70.23,76.96 70.23,82.3 73.28,85.34 75.06,85.34 75.31,85.6 | 75.31,85.6 75.56,85.34 76.84,85.34 76.84,84.84 79.88,84.84 79.88,85.34 81.41,85.34 81.66,85.6 EXPANSION.J2[16] | 75.31,85.6 EXPANSION1.J2[16]
SPARE1  (via drill 0.48, 0.5)  (2 unrouted)
  Top 0.254: 75.31,88.39 75.82,87.88 75.82,86.87 79.38,86.87 79.88,87.38 79.88,88.14 81.66,88.14 EXPANSION.J2[18] | 75.31,88.39 71.75,88.39 71.75,88.14 67.94,84.33 v67.94,79.5 | 75.31,88.39 EXPANSION1.J2[18]
  Bottom 0.254: 67.94,79.25 67.94,61.85 67.56,61.47 67.56,39.65 U$2.B9 65.66,37.59 63.63,37.59 63.66,37.56 | 67.94,79.25 | 65.79,37.72 63.82,37.72 63.66,37.56 | 63.66,37.56 59.75,33.53 v46.35,34.92 | U$1.B9 49.62,140.94 45.34,145.22 36.89,145.22 6.35,114.68 6.35,91.31 21.21,76.45 21.21,50.29 | 67.94,79.25 v67.94,79.5
  other vias: 42.42,25.53
SPARE2  (via drill 0.48, 0.5)
  Top 0.254: 67.44,164.34 57.91,164.34 7.87,114.3 v7.62,86.11 | 67.44,164.34 67.56,164.34 | v6.6,78.36 33.05,53.95 U$2.A20 | v69.47,118.11 69.47,147.57 77.6,155.7 77.6,156.02 69.33,164.29 U$1.A20 67.44,164.34
  Bottom 0.254: v7.62,86.11 v6.6,78.36 | 77.85,116.08 78.1,115.82 79.63,115.82 79.63,115.57 80.14,115.06 82.42,115.06 82.42,115.32 84.2,115.32 84.2,116.08 EXPANSION.J2[39] | 77.85,116.08 77.85,115.32 72.26,115.32 v69.47,118.11 | 77.85,116.08 EXPANSION1.J2[39]
SPARE3  (via drill 0.48)
  Top 0.254: EXPANSION.J2[40] 81.66,116.08 79.88,116.08 79.88,115.32 79.38,114.81 75.82,114.81 75.82,115.82 75.31,116.33 EXPANSION1.J2[40] | v63.88,97.79 65.91,99.82 65.91,101.6 67.69,103.38 67.69,109.47 72.26,114.05 v72.26,116.59
  Bottom 0.254: U$2.B20 59.56,71.16 59.56,97.79 | 59.56,97.79 59.56,98.07 | U$1.B20 71.13,162.48 67.06,166.56 67.06,170.05 75.31,178.31 82.04,178.31 88.58,171.77 | 88.58,171.77 88.65,171.7 88.65,121.16 | EXPANSION.J2[40] 81.91,116.33 81.91,117.09 83.69,117.09 83.69,117.35 85.98,117.35 87.25,118.62 87.25,120.9 88.77,120.9 88.77,171.7 88.52,171.7 88.58,171.77 | 59.56,97.79 v63.88,97.79 | v72.26,116.59 75.06,116.59 75.31,116.33 EXPANSION1.J2[40]
SPARE4  (via drill 0.48, 0.5)
  Top 0.254: 69.22,166.12 58.67,166.12 7.11,114.55 v6.73,86.99 | 69.22,166.12 69.34,166.12 | v5.71,80.39 32.27,55.74 U$2.A21 | v70.23,120.14 70.23,147.32 80.01,157.1 80.01,157.23 71.15,166.08 U$1.A21 69.22,166.12
  Bottom 0.254: v5.71,80.39 v6.73,86.99 | 77.85,118.62 78.1,118.36 79.63,118.36 79.63,118.11 80.14,117.6 82.42,117.6 82.42,117.86 84.2,117.86 84.2,118.62 EXPANSION.J2[41] | 77.85,118.62 77.85,117.86 72.52,117.86 v70.23,120.14 | 77.85,118.62 EXPANSION1.J2[41]
SPARE5  (via drill 0.48)
  Top 0.254: EXPANSION.J2[42] 81.66,118.62 79.88,118.62 79.88,117.86 79.38,117.35 75.82,117.35 75.82,118.36 75.31,118.87 EXPANSION1.J2[42] | v54.99,109.47 55.24,109.47 55.24,71.63 v57.02,69.85
  Bottom 0.254: U$2.B21 52.5,67.69 54.86,67.69 v57.02,69.85 58.8,71.63 58.8,100.07 | U$1.B21 72.93,164.31 68.9,168.34 68.9,171.01 75.44,177.55 81.79,177.55 88.01,171.32 88.01,131.44 88.01,131.06 | 88.01,131.06 88.01,130.94 | 88.01,131.06 88.01,121.67 87.25,121.67 86.23,120.65 86.23,119.89 83.69,119.89 83.69,119.63 83.44,119.63 83.44,119.38 82.17,119.38 82.17,118.87 81.91,118.87 EXPANSION.J2[42] | v54.99,109.47 66.42,120.9 70.74,120.9 72.52,119.13 75.06,119.13 75.31,118.87 EXPANSION1.J2[42]
SPI_CLK  (via drill 0.48, 0.5)
  Top 0.254: 67.18,112.52 67.18,112.39 | 67.18,112.52 67.18,148.46 70.74,152.02 70.74,152.15 63.99,158.9 U$1.A17 62.1,158.75 55.5,158.75 55.44,158.81 | 62.1,158.88 55.5,158.88 55.44,158.81 | 55.44,158.81 10.16,113.54 v10.16,83.19 | v9.65,71.5 35.39,48.56 U$2.A17 | 67.18,112.52 v67.44,112.52
  Bottom 0.254: v10.16,83.19 v9.65,71.5 | EXPANSION.J2[33] 84.2,108.46 84.2,107.7 82.42,107.7 82.42,107.44 80.14,107.44 79.63,107.95 79.63,108.2 78.1,108.2 77.85,108.46 EXPANSION1.J2[33] 77.85,109.73 70.23,109.73 v67.44,112.52
SPI_CS1  (via drill 0.48)  (1 unrouted)
  Top 0.254: 75.31,103.12 76.07,103.12 76.07,102.11 79.38,102.11 79.88,102.62 79.88,103.38 81.66,103.38 EXPANSION.J2[30] | 75.31,103.12 EXPANSION1.J2[30] 75.31,103.12 | 75.31,103.12 72.77,103.12 72.77,100.33 64.64,92.2 64.64,89.66 v63.37,88.39
  Bottom 0.254: U$2.B15 60.83,54.47 60.83,64.77 63.37,67.31 v63.37,88.39 | U$1.B15 62.15,153.49 58.1,157.54 58.1,165.55 74.68,182.12 82.68,182.12 91.82,172.97 91.82,130.94 | 91.82,111.25 91.82,111.19 | 91.82,111.25 91.82,131.06 | 91.82,111.25 90.3,111.25 90.04,111 90.04,106.93 88.26,106.93 85.98,104.65 83.69,104.65 83.69,104.39 83.44,104.39 83.44,104.14 82.17,104.14 82.17,103.63 81.91,103.63 EXPANSION.J2[30]
SPI_CS2  (via drill 0.48)  (1 unrouted)
  Top 0.254: EXPANSION.J2[32] 81.66,105.92 79.88,105.92 79.88,105.16 79.38,104.65 75.82,104.65 75.82,105.66 75.31,106.17 EXPANSION1.J2[32] | v71.75,105.66 66.42,100.33 66.42,98.81 64.13,96.52 64.13,91.95 v62.61,90.42
  Bottom 0.254: U$2.B16 59.44,56.66 59.44,65.41 62.61,68.58 v62.61,90.42 | U$1.B16 63.95,155.31 59.88,159.38 59.88,166.43 74.8,181.36 82.55,181.36 91.12,172.78 | 91.12,172.78 91.19,172.72 91.19,130.94 | 91.19,113.16 91.19,131.06 | v71.75,105.66 75.06,105.66 75.31,105.92 EXPANSION1.J2[32] | EXPANSION.J2[32] 81.91,106.17 81.91,106.93 83.69,106.93 83.69,107.19 85.98,107.19 89.53,110.74 89.53,113.79 91.06,113.79 91.31,114.05 91.31,172.72 91.06,172.72 91.12,172.78
SPI_CS3  (via drill 0.48)  (1 unrouted)
  Top 0.254: EXPANSION.J2[34] 81.66,108.46 79.88,108.46 79.88,107.7 79.38,107.19 75.82,107.19 75.82,108.2 75.31,108.71 EXPANSION1.J2[34] | v72.52,108.2 72.52,104.9 v68.45,100.84 | v72.52,96.77 67.18,91.44 v67.18,91.19
  Bottom 0.254: U$2.B17 58.42,59.24 58.42,65.91 61.85,69.34 61.85,91.69 | 61.85,91.69 61.85,92.07 | U$1.B17 65.75,157.14 61.72,161.16 61.72,167.39 74.93,180.59 82.42,180.59 90.55,172.47 90.55,130.94 | 90.55,115.57 90.55,115.19 | 90.55,115.57 90.55,131.06 | 90.55,115.57 89.03,115.57 89.03,112.78 85.98,109.73 83.69,109.73 83.69,109.47 81.91,109.47 81.91,108.71 EXPANSION.J2[34] | v72.52,108.2 75.06,108.2 75.31,108.46 EXPANSION1.J2[34] | v72.52,96.77 v68.45,100.84 | v67.18,91.19 66.68,91.69 61.85,91.69
SPI_IN  (via drill 0.48, 0.5)  (1 unrouted)
  Top 0.254: v65.66,109.98 65.66,150.05 60.4,155.31 U$1.A15 58.55,155.45 53.98,155.45 53.98,155.19 53.91,155.26 | 58.42,155.32 53.98,155.32 53.91,155.26 | 53.91,155.26 11.68,113.03 v12.32,81.28 | U$2.A15 36.95,44.96 v11.81,66.42
  Bottom 0.254: v12.32,81.28 v11.81,66.42 | EXPANSION.J2[29] 84.2,103.38 83.95,103.12 83.95,102.36 80.14,102.36 79.63,102.87 79.63,103.12 78.1,103.12 77.85,103.38 EXPANSION1.J2[29] 77.85,104.65 70.99,104.65 v65.66,109.98
SPI_OUT  (via drill 0.48, 0.5)  (1 unrouted)
  Top 0.254: v66.42,112.01 66.42,148.72 68.45,150.75 68.45,150.81 62.16,157.1 U$1.A16 60.32,156.97 54.74,156.97 54.67,157.04 | 60.32,157.1 54.74,157.1 54.67,157.04 | 54.67,157.04 10.92,113.28 v11.18,82.17 | U$2.A16 36.17,46.76 v10.79,68.83
  Bottom 0.254: v11.18,82.17 v10.79,68.83 | EXPANSION.J2[31] 84.2,105.92 84.2,105.16 82.42,105.16 82.42,104.9 80.14,104.9 79.63,105.41 79.63,105.66 78.1,105.66 77.85,105.92 EXPANSION1.J2[31] 77.85,107.19 71.25,107.19 v66.42,112.01

### Text on the board
tPlace: AQUA URSA BACKPLANE 2013 | W FISCHER | M BUJOLD | 1 | 1